# EAGLE design MODULO2_ps (EAGLE 7.1.0)
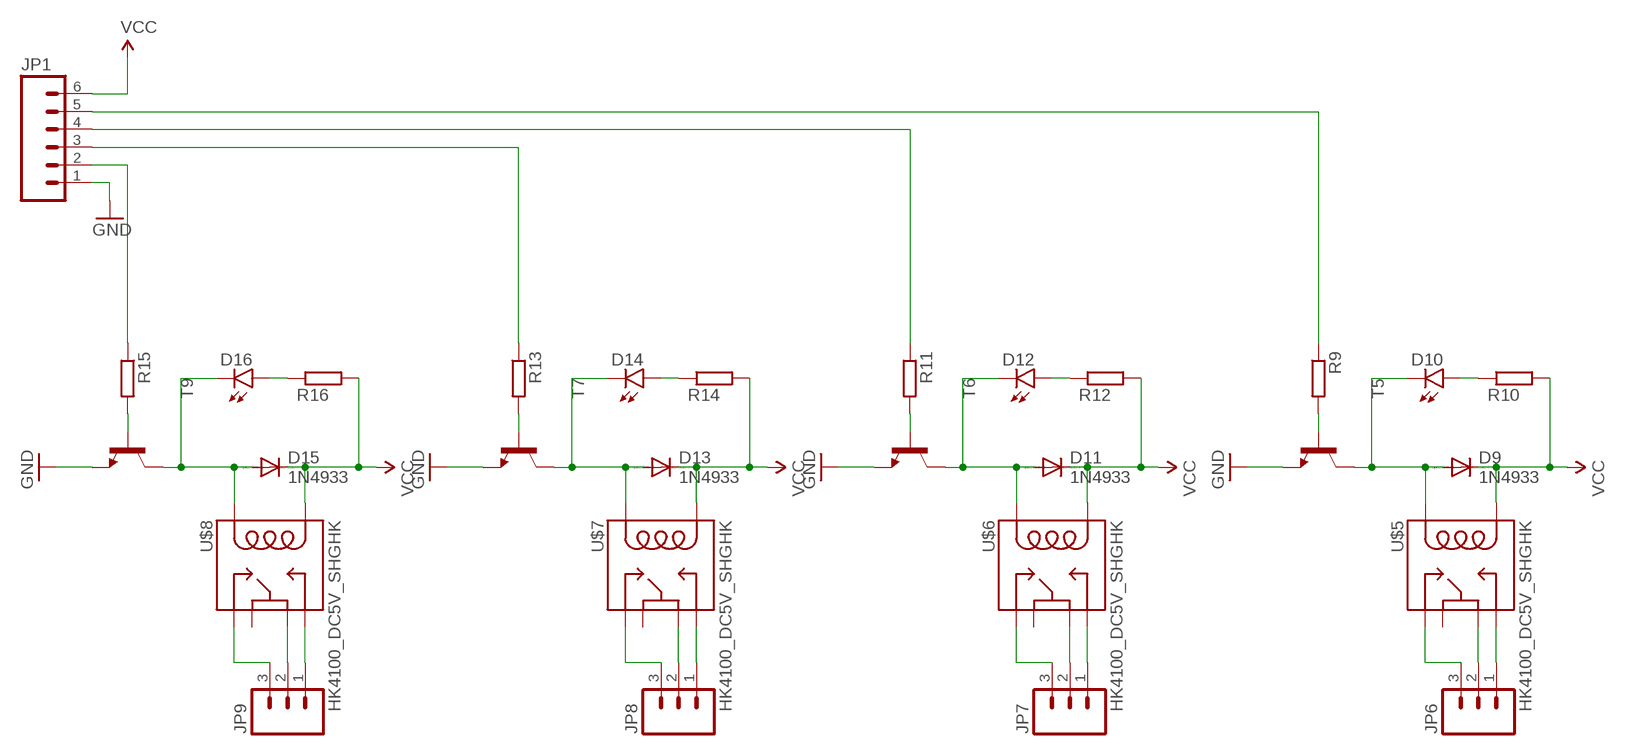
[diagram p0: schematic, sheet 1]

## Parts
D9  1N4933  [DO41-10]
D10  LED5MM  [LED5MM]
D11  1N4933  [DO41-10]
D12  LED5MM  [LED5MM]
D13  1N4933  [DO41-10]
D14  LED5MM  [LED5MM]
D15  1N4933  [DO41-10]
D16  LED5MM  [LED5MM]
JP1  M06SILK_FEMALE_PTH  [1X06]
JP6  M03-SCREW-5MM  [SCREWTERMINAL-5MM-3]
JP7  M03-SCREW-5MM  [SCREWTERMINAL-5MM-3]
JP8  M03-SCREW-5MM  [SCREWTERMINAL-5MM-3]
JP9  M03-SCREW-5MM  [SCREWTERMINAL-5MM-3]
R9  R-EU_R0805  [R0805]
R10  R-EU_R0805  [R0805]
R11  R-EU_R0805  [R0805]
R12  R-EU_R0805  [R0805]
R13  R-EU_R0805  [R0805]
R14  R-EU_R0805  [R0805]
R15  R-EU_R0805  [R0805]
R16  R-EU_R0805  [R0805]
T5  -NPN-TO92-EBC  [TO92-EBC]
T6  -NPN-TO92-EBC  [TO92-EBC]
T7  -NPN-TO92-EBC  [TO92-EBC]
T9  -NPN-TO92-EBC  [TO92-EBC]
U$5  HK4100_DC5V_SHGHK  [HK4100]
U$6  HK4100_DC5V_SHGHK  [HK4100]
U$7  HK4100_DC5V_SHGHK  [HK4100]
U$8  HK4100_DC5V_SHGHK  [HK4100]

## Nets
GND: JP1.1 T5.E T6.E T7.E T9.E
N$17: D9.A D10.K(C) T5.C U$5.6
N$18: D10.A R10.1
N$19: R9.2 T5.B
N$20: D11.A D12.K(C) T6.C U$6.6
N$21: D12.A R12.1
N$22: R11.2 T6.B
N$23: D13.A D14.K(C) T7.C U$7.6
N$24: D14.A R14.1
N$25: R13.2 T7.B
N$26: D15.A D16.K(C) T9.C U$8.6
N$27: D16.A R16.1
N$28: R15.2 T9.B
N$29: JP1.4 R11.1
N$30: JP1.5 R9.1
N$31: JP1.3 R13.1
N$32: JP1.2 R15.1
N$45: JP6.1 U$5.8
N$46: JP6.2 U$5.14
N$47: JP6.3 U$5.7
N$48: JP7.1 U$6.8
N$49: JP7.2 U$6.14
N$50: JP7.3 U$6.7
N$51: JP8.1 U$7.8
N$52: JP8.2 U$7.14
N$53: JP8.3 U$7.7
N$54: JP9.1 U$8.8
N$55: JP9.2 U$8.14
N$56: JP9.3 U$8.7
VCC: D9.C D11.C D13.C D15.C JP1.6 R10.2 R12.2 R14.2 R16.2 U$5.9 U$6.9 U$7.9 U$8.9
Unconnected: U$5.1 U$6.1 U$7.1 U$8.1

## Library data of the parts
D9 D11 D13 D15 = diode:1N4933: DIODE fast recovery rectifier, 1A
D10 D12 D14 D16 = SparkFun-LED:LED: LEDs Standard schematic elements and footprints for 5mm, 3mm, 1206, and 0603 sized LEDs. 5mm - Spark Fun Electronics SKU : COM-00529 (and others)
JP1 = SparkFun-Connectors:M06: Header 6 Standard 6-pin 0.1" header. Use with straight break away headers (SKU : PRT-00116), right angle break away headers (PRT-00553), swiss pins (PRT-00743), machine pins (PRT-00117), and female headers (PRT-00115). Molex polarized connector foot print use with SKU : PRT-08094 with associated crimp pins and housings. NOTES ON THE VARIANTS LOCK and LOCK_LONGPADS... This footprint was designed to help hold the alignment of a through-hole component (i.e. 6-pin header) while soldering it into place. You may notice that each hole has been shifted either up or down by 0.005 of an inch from it's more standard position (which is a perfectly straight line). This slight alteration caused the pins (the squares in the middle) to touch the edges of the holes. Because they are alternating, it causes a "brace" to hold the component in place. 0.005 has proven to be the perfect amount of "off-center" position when using our standard breakaway headers. Although looks a little odd when you look at the bare footprint, once you have a header in there, the alteration is very hard to notice. Also,if you push a header all the way into place, it is covered up entirely on the bottom side. This idea of altering the position of holes to aid alignment will be further integrated into the Sparkfun Library for other footprints. It can help hold any component with 3 or more connection pins.; PROD_ID: CONN-08437
JP6-JP9 = SparkFun-Connectors:M03: Header 3 Standard 3-pin 0.1" header. Use with straight break away headers (SKU : PRT-00116), right angle break away headers (PRT-00553), swiss pins (PRT-00743), machine pins (PRT-00117), and female headers (PRT-00115). Molex polarized connector foot print use with SKU : PRT-08232 with associated crimp pins and housings.; STOREFRONT_ID: PRT-08433
R9-R16 = resistor:R-EU_: RESISTOR, European symbol
T5-T7 T9 = transistor:*-NPN-: NPN Transistror BF959 corrected 2008.03.06
U$5-U$8 = SparkFun-Electromechanical:HK4100_DC5V_SHG

## Board
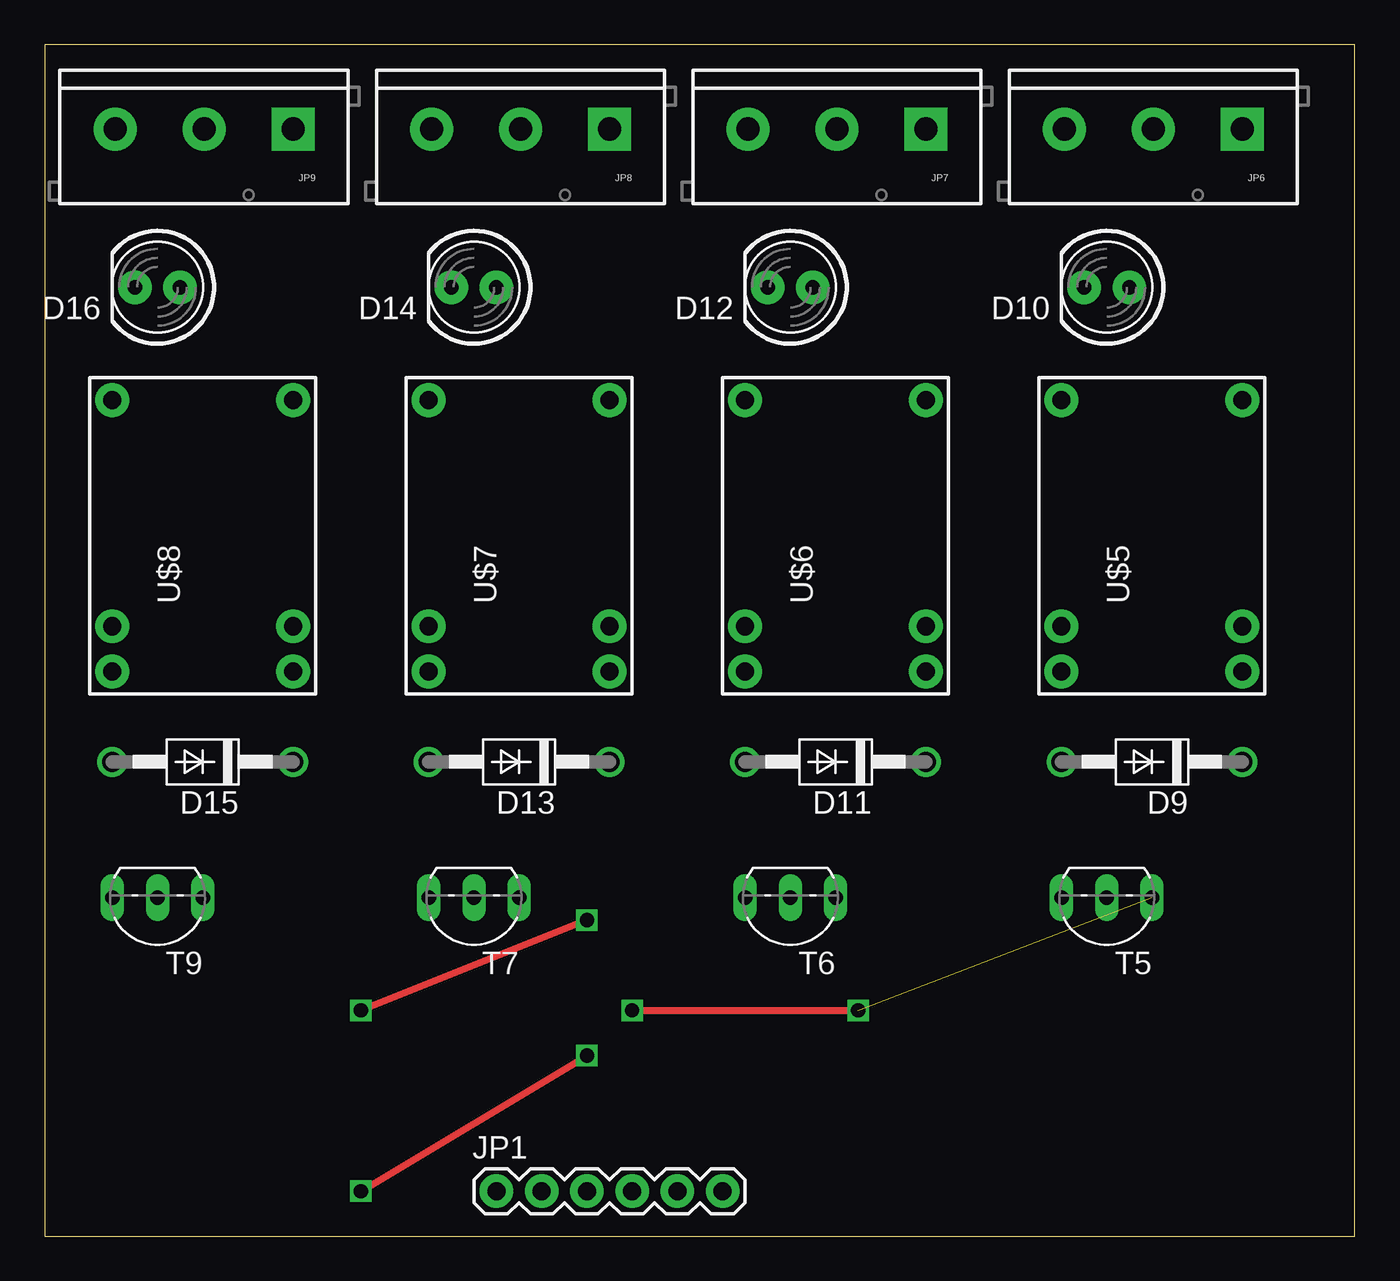
[diagram p1: board, top side]
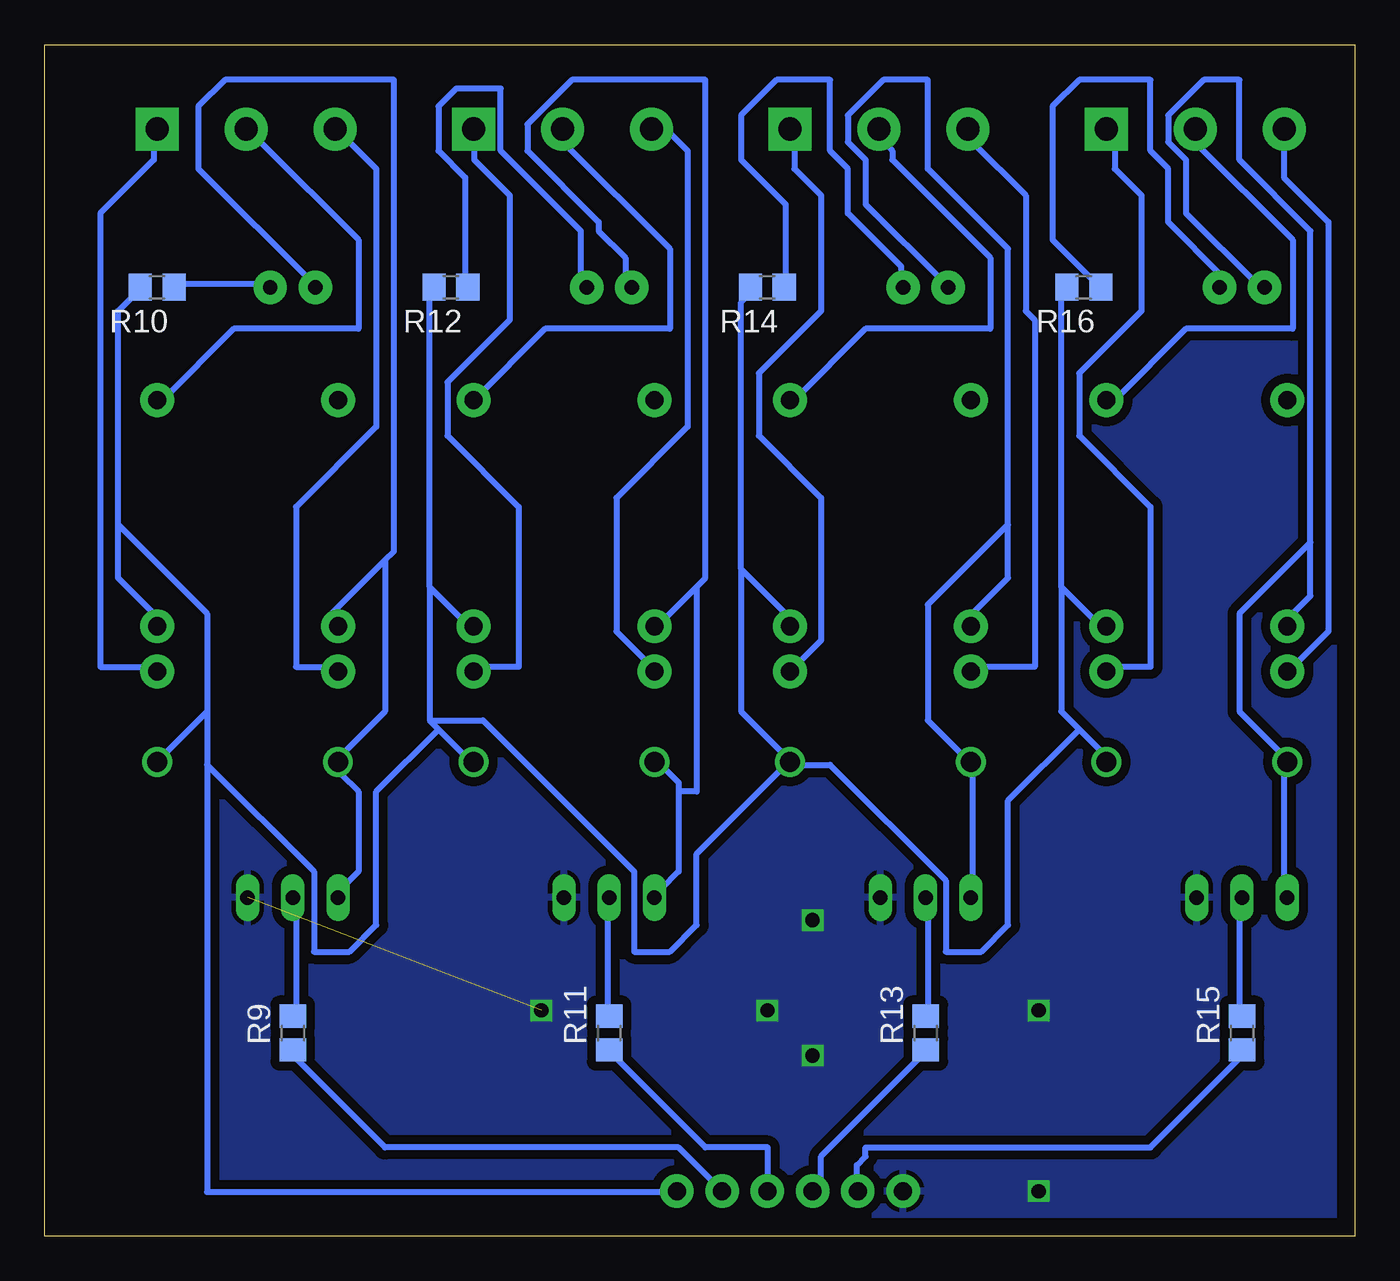
[diagram p2: board, bottom side, seen from below]

Size 73.64 x 66.98 mm. Coordinates in mm from the lower left corner, seen from the top.
Outline: 0,0 73.64,0 73.64,66.98 0,66.98 0,0
Copper layers (1*16): Top 0.035mm / dielectric 1.5mm / Bottom 0.035mm
Design rules "regole": minimum track width 13mil, minimum drill 24mil, track to track 20mil, track to pad 6mil, pad to pad 8mil, via to via 8mil, smd to smd 8mil, copper to edge 40mil, drill to drill 8mil, minimum pad ring 10mil, minimum via ring 8mil, stop-mask expansion 4mil, vias tented up to drill 0mil, thermal gap 10mil

### Footprints (pad centres in the part's own frame; a part is rotated, then mirrored left to right if it is on the bottom)
DO41-10 = drill 1.118: A 5.08,0; C -5.08,0
LED5MM = drill 0.813 pad 1.88: A -1.27,0; K 1.27,0
1X06 = drill 1.016 pad 1.88: 1 0,0; 2 2.54,0; 3 5.08,0; 4 7.62,0; 5 10.16,0; 6 12.7,0
SCREWTERMINAL-5MM-3 = drill 1.3 pad 2.413 square: 1 0,0 | drill 1.3 pad 2.413: 2 5,0; 3 10,0
R0805 = smd 1.3 x 1.5: 1 -0.95,0; 2 0.95,0
TO92-EBC = drill 0.813 long: B 0,-1.27; C 2.54,-1.27; E -2.54,-1.27
HK4100 = drill 1.016 pad 1.905: 1 7.62,5.08; 6 -5.08,5.08; 7 -7.62,5.08; 8 -7.62,-5.08; 9 -5.08,-5.08; 14 7.62,-5.08

### Placement (x,y rotation side)
D9  62.23,26.67 180 top
D10  59.69,53.34 180 top
D11  44.45,26.67 180 top
D12  41.91,53.34 180 top
D13  26.67,26.67 180 top
D14  24.13,53.34 180 top
D15  8.89,26.67 180 top
D16  6.35,53.34 180 top
JP1  25.4,2.54 0 top
JP6  67.31,62.23 180 top
JP7  49.53,62.23 180 top
JP8  31.75,62.23 180 top
JP9  13.97,62.23 180 top
R9  59.69,11.43 90 bottom
R10  67.31,53.34 180 bottom
R11  41.91,11.43 90 bottom
R12  50.8,53.34 180 bottom
R13  24.13,11.43 90 bottom
R14  33.02,53.34 180 bottom
R15  6.35,11.43 90 bottom
R16  15.24,53.34 180 bottom
T5  59.69,17.78 180 top
T6  41.91,17.78 180 top
T7  24.13,17.78 180 top
T9  6.35,17.78 180 top
U$5  62.23,39.37 90 top
U$6  44.45,39.37 90 top
U$7  26.67,39.37 90 top
U$8  8.89,39.37 90 top

### Tracks (layer width: path | path; a pad name or v marks a point on that pad's centre or on a via)
GND  (via drill 0.8)  (1 unrouted)
  Top 0.406: v17.78,2.54 v30.48,10.16 | v33.02,12.7 v45.72,12.7 | v17.78,12.7 v30.48,17.78
  pour Bottom (isolate 0.508): 0,0 0,67.31 73.66,67.31 73.66,0
N$17
  Bottom 0.33: T5.C 57,19.5 56,20.5 56,25 57,26 57,26.5 D9.A 57,27 54.5,29.5 54.5,38 | 54.5,38 57.5,35 57.5,34.5 U$5.6 | 54.5,38 54,38.5 54,65 63.5,65 65,63.5 65,60 58.5,53.5 D10.K
N$18
  Bottom 0.33: R10.1 66,53.5 61,53.5 D10.A
N$19
  Bottom 0.33: R9.2 59.5,12.5 59.5,19 T5.B
N$20
  Bottom 0.33: 38,25 38,25.5 39,26.5 D11.A | 38,25 38,20.5 39,19.5 T6.C | 37,36.5 39,34.5 U$6.6 | 37,36.5 36.5,37 36.5,65 44,65 46.5,62.5 46.5,61 42.5,57 42.5,56.5 41,55 41,53.5 D12.K | 38,25 37,25 37,36.5
N$21
  Bottom 0.33: R12.1 50,53.5 50,59.5 51.5,61 51.5,63.5 50.5,64.5 48,64.5 48,61 43.5,56.5 43.5,53.5 D12.A
N$22
  Bottom 0.33: R11.2 42,12.5 42,19 T6.B
N$23
  Bottom 0.33: T7.C 21.5,19.5 21.5,26.5 D13.A 22,27 24,29 24,35.5 19.5,40 | 19.5,40 19.5,37 21.5,35 21.5,34.5 U$7.6 | 19.5,40 19.5,55.5 24,60 24,65 26.5,65 28.5,63 28.5,61.5 27.5,60.5 27.5,58 23,53.5 D14.K
N$24
  Bottom 0.33: R14.1 32,53.5 32,58 34.5,60.5 34.5,63 32.5,65 29.5,65 29.5,61 28.5,60 28.5,57.5 25.5,54.5 25.5,53.5 D14.A
N$25
  Bottom 0.33: R13.2 24,12.5 24,19 T7.B
N$26
  Bottom 0.33: T9.C 4,19.5 4,26.5 D15.A 4,27 6.5,29.5 6.5,35 2.5,39 | 2.5,39 2.5,36 3.5,35 3.5,34.5 U$8.6 | 2.5,39 2.5,56.5 6.5,60.5 6.5,65 8.5,65 10.5,63 10.5,61.5 9.5,60.5 9.5,57.5 5.5,53.5 D16.K
N$27
  Bottom 0.33: R16.1 14.5,53.5 17,56 17,63.5 15.5,65 11.5,65 11.5,61 10.5,60 10.5,57 7.5,54 7.5,53.5 D16.A
N$28
  Bottom 0.33: R15.2 6.5,12.5 6.5,19 T9.B
N$29
  Bottom 0.33: R11.1 41.5,10 36.5,5 33,5 33,2.5 JP1.4
N$30
  Bottom 0.33: R9.1 59.5,10 54.5,5 38,5 36,3 JP1.5
N$31
  Bottom 0.33: R13.1 24.5,10 30,4.5 30,3 JP1.3
N$32
  Bottom 0.33: R15.1 6.5,10 11.5,5 27.5,5 27.5,4.5 28,4 28,2.5 JP1.2
N$45
  Bottom 0.33: U$5.8 67.5,32 70.5,32 70.5,57.5 67.5,60.5 67.5,62 JP6.1
N$46
  Bottom 0.33: U$5.14 67,47 63,51 56,51 56,56 61.5,61.5 62,61.5 62,62 JP6.2
N$47
  Bottom 0.33: U$5.7 57.5,32 59.5,32 59.5,41 55,45.5 55,60 56.5,61.5 57,61.5 57,62 JP6.3
N$48
  Bottom 0.33: U$6.8 49.5,32 47,32 47,41 51,45 51,48 47.5,51.5 47.5,58.5 49.5,60.5 49.5,62 JP7.1
N$49
  Bottom 0.33: U$6.14 49.5,47 45.5,51 38.5,51 38.5,55.5 44.5,61.5 44.5,62 JP7.2
N$50
  Bottom 0.33: U$6.7 39.5,32 41.5,34 41.5,41.5 37.5,45.5 37.5,61 38.5,62 39.5,62 JP7.3
N$51
  Bottom 0.33: U$7.8 30,33.5 30,41.5 33.5,45 33.5,48.5 30,52 30,58.5 31.5,60 31.5,62 JP8.1
N$52
  Bottom 0.33: U$7.14 31.5,47 27.5,51 20.5,51 20.5,55 26,60.5 26,61 26.5,61.5 26.5,62 JP8.2
N$53
  Bottom 0.33: U$7.7 21.5,32 18,32 18,51.5 18.5,52 18.5,58.5 21.5,61.5 21.5,62 JP8.3
N$54
  Bottom 0.33: U$8.8 13.5,32 11.5,32 11.5,41 15.5,45 15.5,48.5 12,52 12,58.5 13.5,60 13.5,62 JP9.1
N$55
  Bottom 0.33: U$8.14 13.5,47 9.5,51 3.5,51 3.5,56 9,61.5 9,62 JP9.2
N$56
  Bottom 0.33: U$8.7 3.5,32 1.5,34 1.5,57 4,59.5 4,62 JP9.3
VCC
  Bottom 0.33: 16.5,36.5 16.5,53 R16.2 | 16.5,36.5 14,34 U$8.9 | 15.5,28.5 16.5,29.5 16.5,36.5 | 15.5,28.5 14,27 D15.C | 34.5,37.5 34.5,52.5 34,53 R14.2 | 34.5,37.5 32,35 32,34.5 U$7.9 | 34.5,37.5 34.5,29.5 32,27 D13.C | 15.5,28.5 19.5,24.5 19.5,17.5 21,16 23,16 23,20 29.5,26.5 31.5,26.5 D13.C | 52,36.5 52,53 R12.2 | 52,36.5 50,34.5 U$6.9 | 52,29 51.5,28.5 | 51.5,28.5 50,27 D11.C | 52,36.5 52,29 | 69.5,40 69.5,37 67.5,35 67.5,34.5 U$5.9 | 69.5,40 69.5,52 68.5,53 R10.2 | 64.5,29.5 67,27 D9.C | 64.5,29.5 64.5,35 69.5,40 | 64.5,29.5 64.5,26.5 | 64.5,26.5 64.5,2.5 38.5,2.5 JP1.6 | 51.5,28.5 55,25 55,17.5 56.5,16 58.5,16 58.5,20.5 64.5,26.5 | 52,29 49,29 40.5,20.5 40.5,16 38.5,16 37,17.5 37,21.5 32,26.5 D13.C